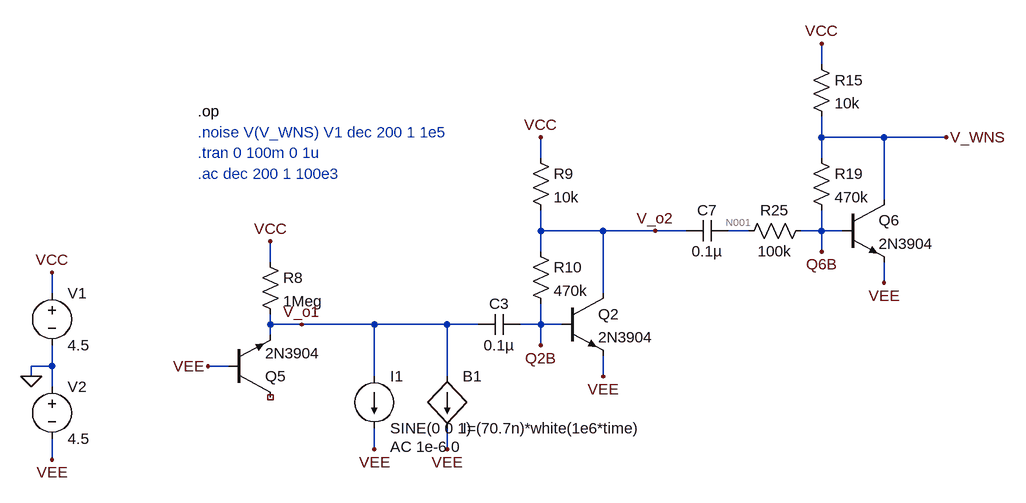
[diagram p0: schematic White Noise Full.asc]
White Noise Full.asc, the LTspice schematic file:
Version 4.1
SHEET 1 1048 680
WIRE 656 -256 656 -288
WIRE 656 -144 656 -176
WIRE 752 -144 656 -144
WIRE 848 -144 752 -144
WIRE 224 -112 224 -144
WIRE 656 -112 656 -144
WIRE 752 -48 752 -144
WIRE 224 0 224 -32
WIRE 320 0 224 0
WIRE 400 0 320 0
WIRE 448 0 400 0
WIRE 544 0 512 0
WIRE 656 0 656 -32
WIRE 656 0 624 0
WIRE 688 0 656 0
WIRE 224 32 224 0
WIRE 656 32 656 0
WIRE -192 48 -192 16
WIRE 752 80 752 48
WIRE -528 96 -528 64
WIRE 320 96 320 0
WIRE -192 144 -192 128
WIRE -144 144 -192 144
WIRE -32 144 -144 144
WIRE 80 144 -32 144
WIRE 128 144 80 144
WIRE 224 144 224 112
WIRE 224 144 192 144
WIRE 256 144 224 144
WIRE -192 160 -192 144
WIRE 224 176 224 144
WIRE -528 208 -528 176
WIRE -528 208 -560 208
WIRE -256 208 -288 208
WIRE -560 224 -560 208
WIRE -32 224 -32 144
WIRE 80 224 80 144
WIRE 320 224 320 192
WIRE -528 240 -528 208
WIRE -32 336 -32 304
WIRE 80 336 80 304
WIRE -528 352 -528 320
FLAG -528 64 VCC
FLAG -528 352 VEE
FLAG -560 224 0
FLAG -288 208 VEE
FLAG -192 16 VCC
FLAG -144 144 V_o1
FLAG 224 -144 VCC
FLAG 320 224 VEE
FLAG 400 0 V_o2
FLAG 656 -288 VCC
FLAG 752 80 VEE
FLAG 848 -144 V_WNS
FLAG 80 336 VEE
FLAG -32 336 VEE
FLAG 224 176 Q2B
FLAG 656 32 Q6B
SYMBOL res -208 32 R0
SYMATTR InstName R8
SYMATTR Value 1Meg
SYMBOL voltage -528 80 R0
WINDOW 123 0 0 Left 0
WINDOW 39 0 0 Left 0
SYMATTR InstName V1
SYMATTR Value 4.5
SYMBOL voltage -528 224 R0
WINDOW 123 0 0 Left 0
WINDOW 39 0 0 Left 0
SYMATTR InstName V2
SYMATTR Value 4.5
SYMBOL npn -256 256 M180
SYMATTR InstName Q5
SYMATTR Value 2N3904
SYMBOL cap 192 128 R90
WINDOW 0 0 32 VBottom 2
WINDOW 3 32 32 VTop 2
SYMATTR InstName C3
SYMATTR Value 0.1µ
SYMBOL res 208 -128 R0
SYMATTR InstName R9
SYMATTR Value 10k
SYMBOL npn 256 96 R0
SYMATTR InstName Q2
SYMATTR Value 2N3904
SYMBOL res 208 16 R0
SYMATTR InstName R10
SYMATTR Value 470k
SYMBOL cap 512 -16 R90
WINDOW 0 0 32 VBottom 2
WINDOW 3 32 32 VTop 2
SYMATTR InstName C7
SYMATTR Value 0.1µ
SYMBOL res 640 -16 R90
WINDOW 0 0 56 VBottom 2
WINDOW 3 32 56 VTop 2
SYMATTR InstName R25
SYMATTR Value 100k
SYMBOL res 640 -272 R0
SYMATTR InstName R15
SYMATTR Value 10k
SYMBOL npn 688 -48 R0
SYMATTR InstName Q6
SYMATTR Value 2N3904
SYMBOL res 640 -128 R0
SYMATTR InstName R19
SYMATTR Value 470k
SYMBOL bi 80 224 R0
SYMATTR InstName B1
SYMATTR Value I=(70.7n)*white(1e6*time)
SYMBOL current -32 224 R0
WINDOW 123 24 108 Left 2
WINDOW 39 0 0 Left 0
SYMATTR Value2 AC 1e-6 0
SYMATTR InstName I1
SYMATTR Value SINE(0 0 1)
TEXT -304 -152 Left 2 ;.noise V(V_WNS) V1 dec 200 1 1e5
TEXT -304 -120 Left 2 ;.tran 0 100m 0 1u
TEXT -304 -88 Left 2 ;.ac dec 200 1 100e3
TEXT -304 -184 Left 2 !.op

The netlist it stands for:
* White Noise Full.asc
R8 VCC V_o1 1Meg
V1 VCC 0 4.5
V2 0 VEE 4.5
Q5 NC_01 VEE V_o1 0 2N3904
C3 Q2B V_o1 0.1µ
R9 VCC V_o2 10k
Q2 V_o2 Q2B VEE 0 2N3904
R10 V_o2 Q2B 470k
C7 N001 V_o2 0.1µ
R25 Q6B N001 100k
R15 VCC V_WNS 10k
Q6 V_WNS Q6B VEE 0 2N3904
R19 V_WNS Q6B 470k
B1 V_o1 VEE I=(70.7n)*white(1e6*time)
I1 V_o1 VEE SINE(0 0 1) AC 1e-6 0
.model NPN NPN
.model PNP PNP
.lib standard.bjt
* .noise V(V_WNS) V1 dec 200 1 1e5
* .tran 0 100m 0 1u
* .ac dec 200 1 100e3
.op
.backanno
.end

* Results of the author's LTspice run, read from the files saved beside the schematic
* Operating Point:
*   V(n001) = -3.853 V
*   V(q2b) = -3.853 V
*   V(q6b) = -3.853 V
*   V(v_o1) = 4.5 V
*   V(v_o2) = -2.734 V
*   V(v_wns) = -2.734 V
*   V(vcc) = 4.5 V
*   V(vee) = -4.5 V
*   I(B1) = 0 A
*   I(C3) = 0 A
*   I(C7) = 0 A
*   I(I1) = 0 A
*   I(R10) = 2.381 µA
*   I(R15) = 723.4 µA
*   I(R19) = 2.381 µA
*   I(R25) = 0 A
*   I(R8) = 9.008 pA
*   I(R9) = 723.4 µA
*   I(V1) = -1.447 mA
*   I(V2) = -1.447 mA
*   Ib(Q2) = 2.381 µA
*   Ib(Q5) = -9.008 pA
*   Ib(Q6) = 2.381 µA
*   Ic(Q2) = 721.1 µA
*   Ic(Q5) = 0 A
*   Ic(Q6) = 721.1 µA
*   Ie(Q2) = -723.4 µA
*   Ie(Q5) = 9.006 pA
*   Ie(Q6) = -723.4 µA
*   Is(Q2) = 0 A
*   Is(Q5) = 0 A
*   Is(Q6) = 0 A